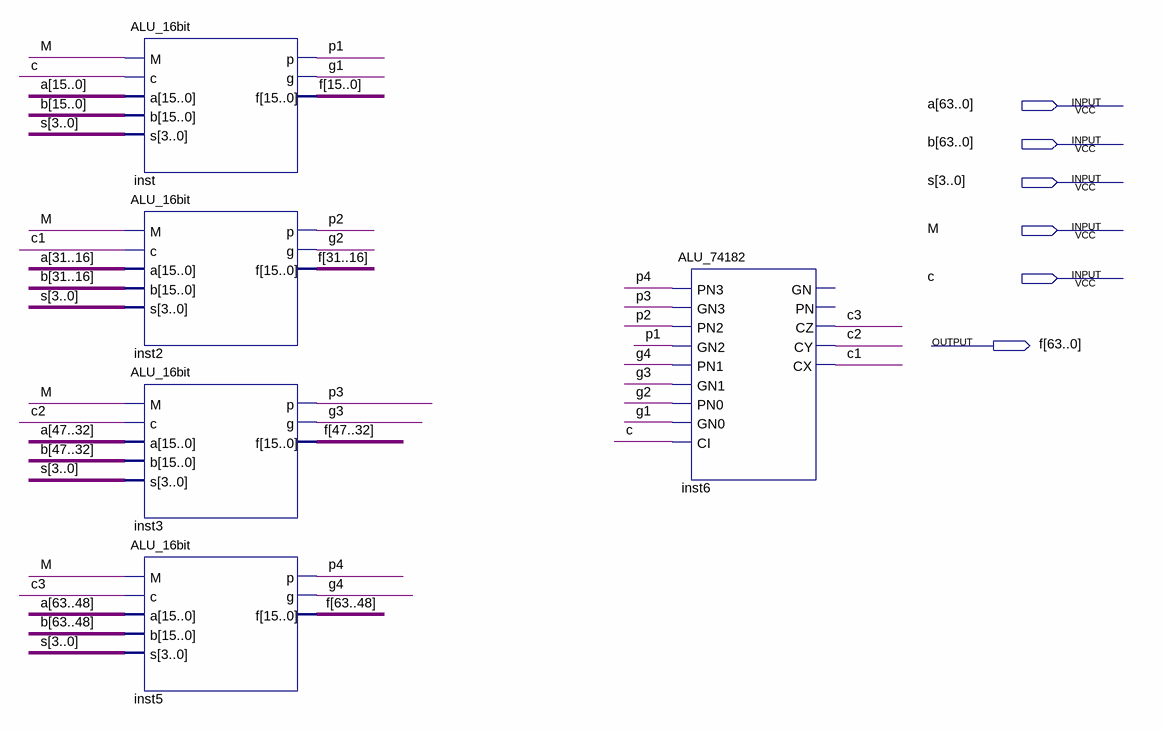
[diagram p0: schematic sheet]
// Quartus schematic ALU_64bit.bdf as structural Verilog: 5 symbols, 6 pins
module ALU_64bit (
  input  [63:0] a,
  input  [63:0] b,
  input  [3:0] s,
  input  M,
  input  c,
  output [63:0] f
);

  wire c1, c2, c3, g1, g2, g3, g4, p1, p2, p3, p4;

  ALU_16bit inst (.M(M), .c(c), .a(a[15:0]), .b(b[15:0]), .s(s), .p(p1), .g(g1), .f(f[15:0]));
  ALU_16bit inst2 (.M(M), .c(c1), .a(a[31:16]), .b(b[31:16]), .s(s), .p(p2), .g(g2), .f(f[31:16]));
  ALU_16bit inst3 (.M(M), .c(c2), .a(a[47:32]), .b(b[47:32]), .s(s), .p(p3), .g(g3), .f(f[47:32]));
  ALU_16bit inst5 (.M(M), .c(c3), .a(a[63:48]), .b(b[63:48]), .s(s), .p(p4), .g(g4), .f(f[63:48]));
  ALU_74182 inst6 (
    .PN3(p4), .GN3(p3), .PN2(p2), .GN2(p1), .PN1(g4), .GN1(g3), .PN0(g2), .GN0(g1), .CI(c), .CZ(c3), .CY(c2),
    .CX(c1));  // open: GN, PN
endmodule
